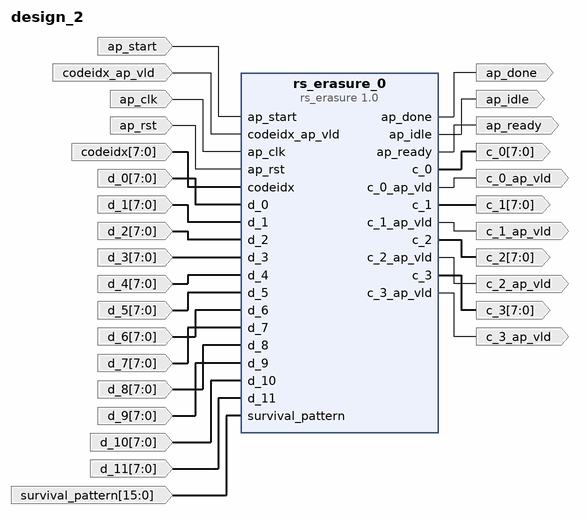
[diagram p0: block diagram of the top level]
# Vivado block design design_2, xc7a35tcpg236-1, Vivado 2018.1
create_bd_design design_2

create_bd_port -dir I ap_start
create_bd_port -dir O ap_done
create_bd_port -dir O ap_idle
create_bd_port -dir O ap_ready
create_bd_port -dir I codeidx_ap_vld
create_bd_port -dir I -type clk ap_clk
create_bd_port -dir I -type rst ap_rst
set_property -dict {CONFIG.POLARITY ACTIVE_HIGH} [get_bd_ports ap_rst]
create_bd_port -dir I -from 7 -to 0 -type data codeidx
set_property -dict [list \
  CONFIG.LAYERED_METADATA {xilinx.com:interface:datatypes:1.0 {DATA {datatype {name {attribs {resolve_type immediate dependency {} format string minimum {} maximum {}} value {}} bitwidth {attribs {resolve_type immediate dependency {} format long minimum {} maximum {}} value 8} bitoffset {attribs {resolve_type immediate dependency {} format long minimum {} maximum {}} value 0} integer {signed {attribs {resolve_type immediate dependency {} format bool minimum {} maximum {}} value false}}}}}} \
] [get_bd_ports codeidx]
create_bd_port -dir I -from 7 -to 0 -type data d_0
set_property -dict [list \
  CONFIG.LAYERED_METADATA {xilinx.com:interface:datatypes:1.0 {DATA {datatype {name {attribs {resolve_type immediate dependency {} format string minimum {} maximum {}} value {}} bitwidth {attribs {resolve_type immediate dependency {} format long minimum {} maximum {}} value 8} bitoffset {attribs {resolve_type immediate dependency {} format long minimum {} maximum {}} value 0} integer {signed {attribs {resolve_type immediate dependency {} format bool minimum {} maximum {}} value false}}}}}} \
] [get_bd_ports d_0]
create_bd_port -dir I -from 7 -to 0 -type data d_1
set_property -dict [list \
  CONFIG.LAYERED_METADATA {xilinx.com:interface:datatypes:1.0 {DATA {datatype {name {attribs {resolve_type immediate dependency {} format string minimum {} maximum {}} value {}} bitwidth {attribs {resolve_type immediate dependency {} format long minimum {} maximum {}} value 8} bitoffset {attribs {resolve_type immediate dependency {} format long minimum {} maximum {}} value 0} integer {signed {attribs {resolve_type immediate dependency {} format bool minimum {} maximum {}} value false}}}}}} \
] [get_bd_ports d_1]
create_bd_port -dir I -from 7 -to 0 -type data d_2
set_property -dict [list \
  CONFIG.LAYERED_METADATA {xilinx.com:interface:datatypes:1.0 {DATA {datatype {name {attribs {resolve_type immediate dependency {} format string minimum {} maximum {}} value {}} bitwidth {attribs {resolve_type immediate dependency {} format long minimum {} maximum {}} value 8} bitoffset {attribs {resolve_type immediate dependency {} format long minimum {} maximum {}} value 0} integer {signed {attribs {resolve_type immediate dependency {} format bool minimum {} maximum {}} value false}}}}}} \
] [get_bd_ports d_2]
create_bd_port -dir I -from 7 -to 0 -type data d_3
set_property -dict [list \
  CONFIG.LAYERED_METADATA {xilinx.com:interface:datatypes:1.0 {DATA {datatype {name {attribs {resolve_type immediate dependency {} format string minimum {} maximum {}} value {}} bitwidth {attribs {resolve_type immediate dependency {} format long minimum {} maximum {}} value 8} bitoffset {attribs {resolve_type immediate dependency {} format long minimum {} maximum {}} value 0} integer {signed {attribs {resolve_type immediate dependency {} format bool minimum {} maximum {}} value false}}}}}} \
] [get_bd_ports d_3]
create_bd_port -dir I -from 7 -to 0 -type data d_4
set_property -dict [list \
  CONFIG.LAYERED_METADATA {xilinx.com:interface:datatypes:1.0 {DATA {datatype {name {attribs {resolve_type immediate dependency {} format string minimum {} maximum {}} value {}} bitwidth {attribs {resolve_type immediate dependency {} format long minimum {} maximum {}} value 8} bitoffset {attribs {resolve_type immediate dependency {} format long minimum {} maximum {}} value 0} integer {signed {attribs {resolve_type immediate dependency {} format bool minimum {} maximum {}} value false}}}}}} \
] [get_bd_ports d_4]
create_bd_port -dir I -from 7 -to 0 -type data d_5
set_property -dict [list \
  CONFIG.LAYERED_METADATA {xilinx.com:interface:datatypes:1.0 {DATA {datatype {name {attribs {resolve_type immediate dependency {} format string minimum {} maximum {}} value {}} bitwidth {attribs {resolve_type immediate dependency {} format long minimum {} maximum {}} value 8} bitoffset {attribs {resolve_type immediate dependency {} format long minimum {} maximum {}} value 0} integer {signed {attribs {resolve_type immediate dependency {} format bool minimum {} maximum {}} value false}}}}}} \
] [get_bd_ports d_5]
create_bd_port -dir I -from 7 -to 0 -type data d_6
set_property -dict [list \
  CONFIG.LAYERED_METADATA {xilinx.com:interface:datatypes:1.0 {DATA {datatype {name {attribs {resolve_type immediate dependency {} format string minimum {} maximum {}} value {}} bitwidth {attribs {resolve_type immediate dependency {} format long minimum {} maximum {}} value 8} bitoffset {attribs {resolve_type immediate dependency {} format long minimum {} maximum {}} value 0} integer {signed {attribs {resolve_type immediate dependency {} format bool minimum {} maximum {}} value false}}}}}} \
] [get_bd_ports d_6]
create_bd_port -dir I -from 7 -to 0 -type data d_7
set_property -dict [list \
  CONFIG.LAYERED_METADATA {xilinx.com:interface:datatypes:1.0 {DATA {datatype {name {attribs {resolve_type immediate dependency {} format string minimum {} maximum {}} value {}} bitwidth {attribs {resolve_type immediate dependency {} format long minimum {} maximum {}} value 8} bitoffset {attribs {resolve_type immediate dependency {} format long minimum {} maximum {}} value 0} integer {signed {attribs {resolve_type immediate dependency {} format bool minimum {} maximum {}} value false}}}}}} \
] [get_bd_ports d_7]
create_bd_port -dir I -from 7 -to 0 -type data d_8
set_property -dict [list \
  CONFIG.LAYERED_METADATA {xilinx.com:interface:datatypes:1.0 {DATA {datatype {name {attribs {resolve_type immediate dependency {} format string minimum {} maximum {}} value {}} bitwidth {attribs {resolve_type immediate dependency {} format long minimum {} maximum {}} value 8} bitoffset {attribs {resolve_type immediate dependency {} format long minimum {} maximum {}} value 0} integer {signed {attribs {resolve_type immediate dependency {} format bool minimum {} maximum {}} value false}}}}}} \
] [get_bd_ports d_8]
create_bd_port -dir I -from 7 -to 0 -type data d_9
set_property -dict [list \
  CONFIG.LAYERED_METADATA {xilinx.com:interface:datatypes:1.0 {DATA {datatype {name {attribs {resolve_type immediate dependency {} format string minimum {} maximum {}} value {}} bitwidth {attribs {resolve_type immediate dependency {} format long minimum {} maximum {}} value 8} bitoffset {attribs {resolve_type immediate dependency {} format long minimum {} maximum {}} value 0} integer {signed {attribs {resolve_type immediate dependency {} format bool minimum {} maximum {}} value false}}}}}} \
] [get_bd_ports d_9]
create_bd_port -dir I -from 7 -to 0 -type data d_10
set_property -dict [list \
  CONFIG.LAYERED_METADATA {xilinx.com:interface:datatypes:1.0 {DATA {datatype {name {attribs {resolve_type immediate dependency {} format string minimum {} maximum {}} value {}} bitwidth {attribs {resolve_type immediate dependency {} format long minimum {} maximum {}} value 8} bitoffset {attribs {resolve_type immediate dependency {} format long minimum {} maximum {}} value 0} integer {signed {attribs {resolve_type immediate dependency {} format bool minimum {} maximum {}} value false}}}}}} \
] [get_bd_ports d_10]
create_bd_port -dir I -from 7 -to 0 -type data d_11
set_property -dict [list \
  CONFIG.LAYERED_METADATA {xilinx.com:interface:datatypes:1.0 {DATA {datatype {name {attribs {resolve_type immediate dependency {} format string minimum {} maximum {}} value {}} bitwidth {attribs {resolve_type immediate dependency {} format long minimum {} maximum {}} value 8} bitoffset {attribs {resolve_type immediate dependency {} format long minimum {} maximum {}} value 0} integer {signed {attribs {resolve_type immediate dependency {} format bool minimum {} maximum {}} value false}}}}}} \
] [get_bd_ports d_11]
create_bd_port -dir I -from 15 -to 0 -type data survival_pattern
set_property -dict [list \
  CONFIG.LAYERED_METADATA {xilinx.com:interface:datatypes:1.0 {DATA {datatype {name {attribs {resolve_type immediate dependency {} format string minimum {} maximum {}} value {}} bitwidth {attribs {resolve_type immediate dependency {} format long minimum {} maximum {}} value 16} bitoffset {attribs {resolve_type immediate dependency {} format long minimum {} maximum {}} value 0} integer {signed {attribs {resolve_type immediate dependency {} format bool minimum {} maximum {}} value false}}}}}} \
] [get_bd_ports survival_pattern]
create_bd_port -dir O -from 7 -to 0 -type data c_3
create_bd_port -dir O -from 7 -to 0 -type data c_2
create_bd_port -dir O -from 7 -to 0 -type data c_1
create_bd_port -dir O -from 7 -to 0 -type data c_0
create_bd_port -dir O c_3_ap_vld
create_bd_port -dir O c_2_ap_vld
create_bd_port -dir O c_1_ap_vld
create_bd_port -dir O c_0_ap_vld

create_bd_cell -type ip -vlnv xilinx.com:hls:rs_erasure:1.0 rs_erasure_0

# ---- connections ----

connect_bd_net [get_bd_ports ap_start] [get_bd_pins rs_erasure_0/ap_start]
connect_bd_net [get_bd_pins rs_erasure_0/ap_done] [get_bd_ports ap_done]
connect_bd_net [get_bd_pins rs_erasure_0/ap_idle] [get_bd_ports ap_idle]
connect_bd_net [get_bd_pins rs_erasure_0/ap_ready] [get_bd_ports ap_ready]
connect_bd_net [get_bd_ports codeidx_ap_vld] [get_bd_pins rs_erasure_0/codeidx_ap_vld]
connect_bd_net [get_bd_ports ap_clk] [get_bd_pins rs_erasure_0/ap_clk]
connect_bd_net [get_bd_ports ap_rst] [get_bd_pins rs_erasure_0/ap_rst]
connect_bd_net [get_bd_ports codeidx] [get_bd_pins rs_erasure_0/codeidx]
connect_bd_net -net d_0_1 [get_bd_ports d_0] [get_bd_pins rs_erasure_0/d_0]
connect_bd_net -net d_1_1 [get_bd_ports d_1] [get_bd_pins rs_erasure_0/d_1]
connect_bd_net -net d_2_1 [get_bd_ports d_2] [get_bd_pins rs_erasure_0/d_2]
connect_bd_net -net d_3_1 [get_bd_ports d_3] [get_bd_pins rs_erasure_0/d_3]
connect_bd_net -net d_4_1 [get_bd_ports d_4] [get_bd_pins rs_erasure_0/d_4]
connect_bd_net -net d_5_1 [get_bd_ports d_5] [get_bd_pins rs_erasure_0/d_5]
connect_bd_net -net d_6_1 [get_bd_ports d_6] [get_bd_pins rs_erasure_0/d_6]
connect_bd_net -net d_7_1 [get_bd_ports d_7] [get_bd_pins rs_erasure_0/d_7]
connect_bd_net -net d_8_1 [get_bd_ports d_8] [get_bd_pins rs_erasure_0/d_8]
connect_bd_net -net d_9_1 [get_bd_ports d_9] [get_bd_pins rs_erasure_0/d_9]
connect_bd_net -net d_10_1 [get_bd_ports d_10] [get_bd_pins rs_erasure_0/d_10]
connect_bd_net -net d_11_1 [get_bd_ports d_11] [get_bd_pins rs_erasure_0/d_11]
connect_bd_net [get_bd_ports survival_pattern] [get_bd_pins rs_erasure_0/survival_pattern]
connect_bd_net [get_bd_pins rs_erasure_0/c_3] [get_bd_ports c_3]
connect_bd_net [get_bd_pins rs_erasure_0/c_2] [get_bd_ports c_2]
connect_bd_net [get_bd_pins rs_erasure_0/c_1] [get_bd_ports c_1]
connect_bd_net [get_bd_pins rs_erasure_0/c_0] [get_bd_ports c_0]
connect_bd_net [get_bd_pins rs_erasure_0/c_3_ap_vld] [get_bd_ports c_3_ap_vld]
connect_bd_net [get_bd_pins rs_erasure_0/c_2_ap_vld] [get_bd_ports c_2_ap_vld]
connect_bd_net [get_bd_pins rs_erasure_0/c_1_ap_vld] [get_bd_ports c_1_ap_vld]
connect_bd_net [get_bd_pins rs_erasure_0/c_0_ap_vld] [get_bd_ports c_0_ap_vld]

validate_bd_design
save_bd_design
